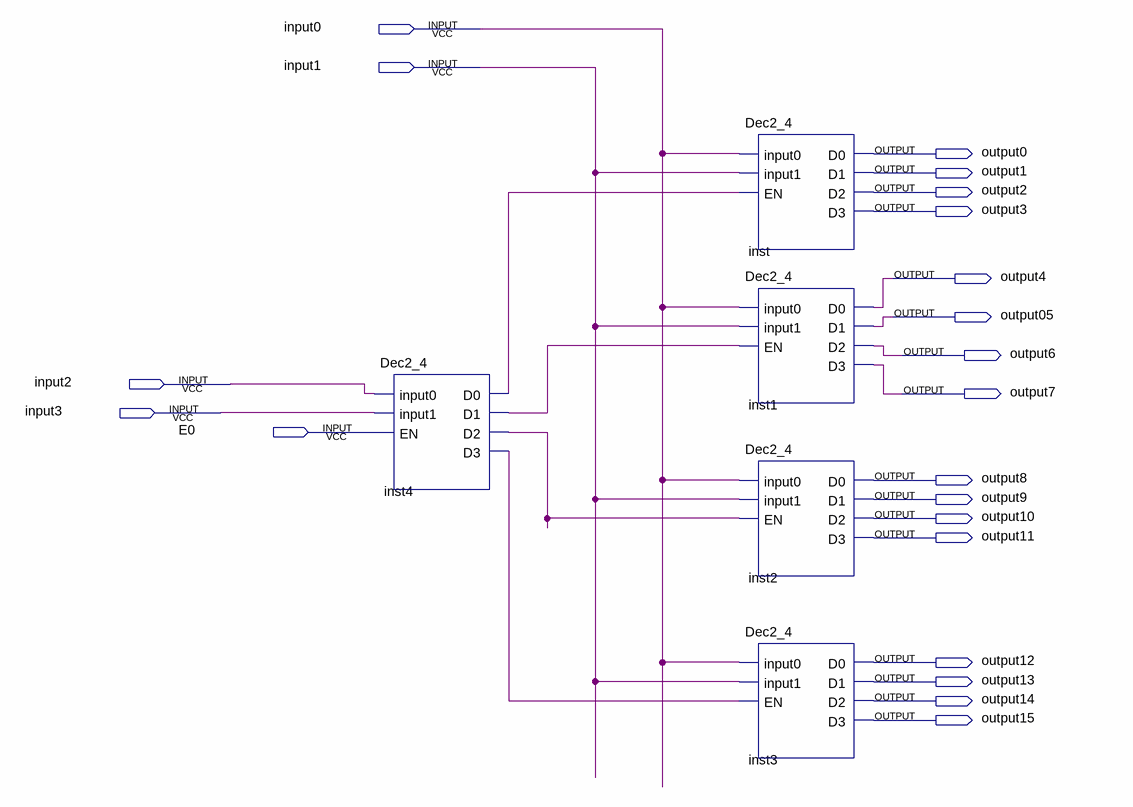
[diagram p0: schematic sheet]
// Quartus schematic Dec4_16.bdf as structural Verilog: 5 symbols, 21 pins
module Dec4_16 (
  input  input0,
  input  input1,
  input  input2,
  input  input3,
  input  E0,
  output output0,
  output output1,
  output output2,
  output output3,
  output output4,
  output output05,
  output output6,
  output output7,
  output output8,
  output output9,
  output output10,
  output output11,
  output output12,
  output output13,
  output output14,
  output output15
);

  wire inst4_d0, inst4_d1, inst4_d2, inst4_d3;

  Dec2_4 inst4 (.input0(input2), .input1(input3), .EN(E0), .D0(inst4_d0), .D1(inst4_d1), .D2(inst4_d2), .D3(inst4_d3));
  Dec2_4 inst (.input0(input0), .input1(input1), .EN(inst4_d0), .D0(output0), .D1(output1), .D2(output2), .D3(output3));
  Dec2_4 inst1 (
    .input0(input0), .input1(input1), .EN(inst4_d1), .D0(output4), .D1(output05), .D2(output6), .D3(output7));
  Dec2_4 inst2 (
    .input0(input0), .input1(input1), .EN(inst4_d2), .D0(output8), .D1(output9), .D2(output10), .D3(output11));
  Dec2_4 inst3 (
    .input0(input0), .input1(input1), .EN(inst4_d3), .D0(output12), .D1(output13), .D2(output14),
    .D3(output15));
endmodule
